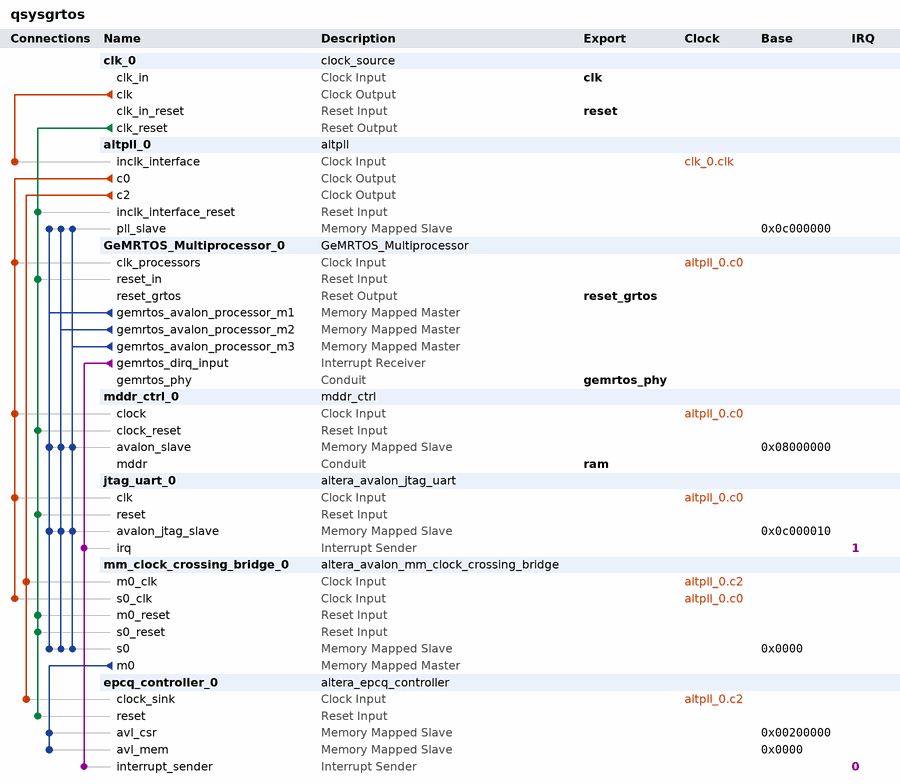
[diagram p0: system contents]
# Platform Designer (Qsys) system qsysgrtos, Cyclone IV E EP4CE22F17C7
# Parameters at their usual value, and those the tool derives, are not listed.
package require -exact qsys 23.1
create_system qsysgrtos
set_project_property DEVICE_FAMILY {Cyclone IV E}
set_project_property DEVICE EP4CE22F17C7

add_instance clk_0 clock_source 23.1
set_instance_parameter_value clk_0 clockFrequency 50000000
set_instance_parameter_value clk_0 resetSynchronousEdges DEASSERT

add_instance altpll_0 altpll 23.1
set_instance_parameter_value altpll_0 CLK0_DIVIDE_BY 5
set_instance_parameter_value altpll_0 CLK0_MULTIPLY_BY 7
set_instance_parameter_value altpll_0 CLK1_DIVIDE_BY 2
set_instance_parameter_value altpll_0 CLK1_DUTY_CYCLE 50
set_instance_parameter_value altpll_0 CLK1_MULTIPLY_BY 1
set_instance_parameter_value altpll_0 CLK1_PHASE_SHIFT 0
set_instance_parameter_value altpll_0 CLK2_DIVIDE_BY 2
set_instance_parameter_value altpll_0 CLK2_DUTY_CYCLE 50
set_instance_parameter_value altpll_0 CLK2_MULTIPLY_BY 1
set_instance_parameter_value altpll_0 CLK2_PHASE_SHIFT 0
set_instance_parameter_value altpll_0 INCLK0_INPUT_FREQUENCY 20000
set_instance_parameter_value altpll_0 PORT_ARESET PORT_UNUSED
set_instance_parameter_value altpll_0 PORT_LOCKED PORT_UNUSED
set_instance_parameter_value altpll_0 PORT_clk1 PORT_USED
set_instance_parameter_value altpll_0 PORT_clk2 PORT_USED
set_instance_parameter_value altpll_0 PORT_clk3 PORT_UNUSED

add_instance GeMRTOS_Multiprocessor_0 GeMRTOS_Multiprocessor 1.0
set_instance_parameter_value GeMRTOS_Multiprocessor_0 BUS_WIDTH 28
set_instance_parameter_value GeMRTOS_Multiprocessor_0 DEVICE_NAME EP4CE22F17C7
set_instance_parameter_value GeMRTOS_Multiprocessor_0 ENABLE_HPS_MAP_ACCESS false
set_instance_parameter_value GeMRTOS_Multiprocessor_0 GeMRTOS_Frequency 70000000
set_instance_parameter_value GeMRTOS_Multiprocessor_0 GeMRTOS_INTERRUPTS 3
set_instance_parameter_value GeMRTOS_Multiprocessor_0 INCLUDE_JTAG_UART_PROCESSOR false
set_instance_parameter_value GeMRTOS_Multiprocessor_0 INCLUDE_JTAG_UART_STDDIO true
set_instance_parameter_value GeMRTOS_Multiprocessor_0 INCLUDE_JTAG_UART_STDERR true
set_instance_parameter_value GeMRTOS_Multiprocessor_0 INDEPENDENT_EXTERNAL_PROCESSOR_BUSES true
set_instance_parameter_value GeMRTOS_Multiprocessor_0 NProcessors 3
set_instance_parameter_value GeMRTOS_Multiprocessor_0 Processor_type {Nios II/f (full)}
set_instance_parameter_value GeMRTOS_Multiprocessor_0 exceptionOffset 0
set_instance_parameter_value GeMRTOS_Multiprocessor_0 exceptionSlave mddr_ctrl_0.avalon_slave
set_instance_parameter_value GeMRTOS_Multiprocessor_0 icache_size_parameter None
set_instance_parameter_value GeMRTOS_Multiprocessor_0 pipelineArch_parameter True
set_instance_parameter_value GeMRTOS_Multiprocessor_0 resetOffset 1048576
set_instance_parameter_value GeMRTOS_Multiprocessor_0 resetSlave epcq_controller_0.avl_mem

add_instance mddr_ctrl_0 mddr_ctrl 1.0
set_instance_parameter_value mddr_ctrl_0 pRefreshCount 780

add_instance jtag_uart_0 altera_avalon_jtag_uart 23.1
set_instance_parameter_value jtag_uart_0 simInteractiveOptions NO_INTERACTIVE_WINDOWS

add_instance mm_clock_crossing_bridge_0 altera_avalon_mm_clock_crossing_bridge 23.1
set_instance_parameter_value mm_clock_crossing_bridge_0 ADDRESS_WIDTH 10
set_instance_parameter_value mm_clock_crossing_bridge_0 COMMAND_FIFO_DEPTH 4
set_instance_parameter_value mm_clock_crossing_bridge_0 DATA_WIDTH 32
set_instance_parameter_value mm_clock_crossing_bridge_0 MASTER_SYNC_DEPTH 2
set_instance_parameter_value mm_clock_crossing_bridge_0 MAX_BURST_SIZE 1
set_instance_parameter_value mm_clock_crossing_bridge_0 RESPONSE_FIFO_DEPTH 4
set_instance_parameter_value mm_clock_crossing_bridge_0 SLAVE_SYNC_DEPTH 2
set_instance_parameter_value mm_clock_crossing_bridge_0 USE_AUTO_ADDRESS_WIDTH 1

add_instance epcq_controller_0 altera_epcq_controller 23.1
set_instance_parameter_value epcq_controller_0 CHIP_SELS 1
set_instance_parameter_value epcq_controller_0 DDASI 0
set_instance_parameter_value epcq_controller_0 FLASH_TYPE EPCS16
set_instance_parameter_value epcq_controller_0 IO_MODE STANDARD
set_instance_parameter_value epcq_controller_0 UNIQUE_ID {$${FILENAME}_epcq_controller_0}
set_instance_parameter_value epcq_controller_0 clkFreq 25000000

# connections
add_connection altpll_0.c0 GeMRTOS_Multiprocessor_0.clk_processors clock
add_connection altpll_0.c0 jtag_uart_0.clk clock
add_connection altpll_0.c0 mddr_ctrl_0.clock clock
add_connection altpll_0.c0 mm_clock_crossing_bridge_0.s0_clk clock
add_connection altpll_0.c2 epcq_controller_0.clock_sink clock
add_connection altpll_0.c2 mm_clock_crossing_bridge_0.m0_clk clock
add_connection clk_0.clk altpll_0.inclk_interface clock
add_connection clk_0.clk_reset altpll_0.inclk_interface_reset reset
add_connection clk_0.clk_reset epcq_controller_0.reset reset
add_connection clk_0.clk_reset GeMRTOS_Multiprocessor_0.reset_in reset
add_connection clk_0.clk_reset jtag_uart_0.reset reset
add_connection clk_0.clk_reset mddr_ctrl_0.clock_reset reset
add_connection clk_0.clk_reset mm_clock_crossing_bridge_0.m0_reset reset
add_connection clk_0.clk_reset mm_clock_crossing_bridge_0.s0_reset reset
add_connection GeMRTOS_Multiprocessor_0.gemrtos_avalon_processor_m1 altpll_0.pll_slave avalon
set_connection_parameter_value GeMRTOS_Multiprocessor_0.gemrtos_avalon_processor_m1/altpll_0.pll_slave baseAddress 0x0c000000
add_connection GeMRTOS_Multiprocessor_0.gemrtos_avalon_processor_m1 jtag_uart_0.avalon_jtag_slave avalon
set_connection_parameter_value GeMRTOS_Multiprocessor_0.gemrtos_avalon_processor_m1/jtag_uart_0.avalon_jtag_slave baseAddress 0x0c000010
add_connection GeMRTOS_Multiprocessor_0.gemrtos_avalon_processor_m1 mddr_ctrl_0.avalon_slave avalon
set_connection_parameter_value GeMRTOS_Multiprocessor_0.gemrtos_avalon_processor_m1/mddr_ctrl_0.avalon_slave baseAddress 0x08000000
add_connection GeMRTOS_Multiprocessor_0.gemrtos_avalon_processor_m1 mm_clock_crossing_bridge_0.s0 avalon
set_connection_parameter_value GeMRTOS_Multiprocessor_0.gemrtos_avalon_processor_m1/mm_clock_crossing_bridge_0.s0 baseAddress 0x0000
add_connection GeMRTOS_Multiprocessor_0.gemrtos_avalon_processor_m2 altpll_0.pll_slave avalon
set_connection_parameter_value GeMRTOS_Multiprocessor_0.gemrtos_avalon_processor_m2/altpll_0.pll_slave baseAddress 0x0c000000
add_connection GeMRTOS_Multiprocessor_0.gemrtos_avalon_processor_m2 jtag_uart_0.avalon_jtag_slave avalon
set_connection_parameter_value GeMRTOS_Multiprocessor_0.gemrtos_avalon_processor_m2/jtag_uart_0.avalon_jtag_slave baseAddress 0x0c000010
add_connection GeMRTOS_Multiprocessor_0.gemrtos_avalon_processor_m2 mddr_ctrl_0.avalon_slave avalon
set_connection_parameter_value GeMRTOS_Multiprocessor_0.gemrtos_avalon_processor_m2/mddr_ctrl_0.avalon_slave baseAddress 0x08000000
add_connection GeMRTOS_Multiprocessor_0.gemrtos_avalon_processor_m2 mm_clock_crossing_bridge_0.s0 avalon
set_connection_parameter_value GeMRTOS_Multiprocessor_0.gemrtos_avalon_processor_m2/mm_clock_crossing_bridge_0.s0 baseAddress 0x0000
add_connection GeMRTOS_Multiprocessor_0.gemrtos_avalon_processor_m3 altpll_0.pll_slave avalon
set_connection_parameter_value GeMRTOS_Multiprocessor_0.gemrtos_avalon_processor_m3/altpll_0.pll_slave baseAddress 0x0c000000
add_connection GeMRTOS_Multiprocessor_0.gemrtos_avalon_processor_m3 jtag_uart_0.avalon_jtag_slave avalon
set_connection_parameter_value GeMRTOS_Multiprocessor_0.gemrtos_avalon_processor_m3/jtag_uart_0.avalon_jtag_slave baseAddress 0x0c000010
add_connection GeMRTOS_Multiprocessor_0.gemrtos_avalon_processor_m3 mddr_ctrl_0.avalon_slave avalon
set_connection_parameter_value GeMRTOS_Multiprocessor_0.gemrtos_avalon_processor_m3/mddr_ctrl_0.avalon_slave baseAddress 0x08000000
add_connection GeMRTOS_Multiprocessor_0.gemrtos_avalon_processor_m3 mm_clock_crossing_bridge_0.s0 avalon
set_connection_parameter_value GeMRTOS_Multiprocessor_0.gemrtos_avalon_processor_m3/mm_clock_crossing_bridge_0.s0 baseAddress 0x0000
add_connection mm_clock_crossing_bridge_0.m0 epcq_controller_0.avl_csr avalon
set_connection_parameter_value mm_clock_crossing_bridge_0.m0/epcq_controller_0.avl_csr baseAddress 0x00200000
add_connection mm_clock_crossing_bridge_0.m0 epcq_controller_0.avl_mem avalon
set_connection_parameter_value mm_clock_crossing_bridge_0.m0/epcq_controller_0.avl_mem baseAddress 0x0000
add_connection GeMRTOS_Multiprocessor_0.gemrtos_dirq_input epcq_controller_0.interrupt_sender interrupt
set_connection_parameter_value GeMRTOS_Multiprocessor_0.gemrtos_dirq_input/epcq_controller_0.interrupt_sender irqNumber 0
add_connection GeMRTOS_Multiprocessor_0.gemrtos_dirq_input jtag_uart_0.irq interrupt
set_connection_parameter_value GeMRTOS_Multiprocessor_0.gemrtos_dirq_input/jtag_uart_0.irq irqNumber 1

# exported interfaces
add_interface clk clock sink
set_interface_property clk EXPORT_OF clk_0.clk_in
add_interface gemrtos_phy conduit end
set_interface_property gemrtos_phy EXPORT_OF GeMRTOS_Multiprocessor_0.gemrtos_phy
add_interface ram conduit end
set_interface_property ram EXPORT_OF mddr_ctrl_0.mddr
add_interface reset reset sink
set_interface_property reset EXPORT_OF clk_0.clk_in_reset
add_interface reset_grtos reset source
set_interface_property reset_grtos EXPORT_OF GeMRTOS_Multiprocessor_0.reset_grtos

set_interconnect_requirement {$system} qsys_mm.clockCrossingAdapter HANDSHAKE
set_interconnect_requirement {$system} qsys_mm.enableEccProtection FALSE
set_interconnect_requirement {$system} qsys_mm.insertDefaultSlave FALSE
set_interconnect_requirement {$system} qsys_mm.maxAdditionalLatency 1

save_system qsysgrtos.qsys
